# EasyEDA Pro project ProPrj_默语小智管家（ESP32版）_2025-03-15.epro, schematic 默语小智管家ESP32扩展板
Board Name: ESP32版小智扩展板; Create Date: 2025-03-10; Page Name: P1; Project Name: 默语小智管家（ESP32版）; Schematic Name: ESP32版小智扩展板; Update Date: 2025-03-10; Company: MolunSmartHome; Drawed: molun; Page Size: A3; Part Number: JLCPCB-001; Reviewed: molun; Version: V0.1
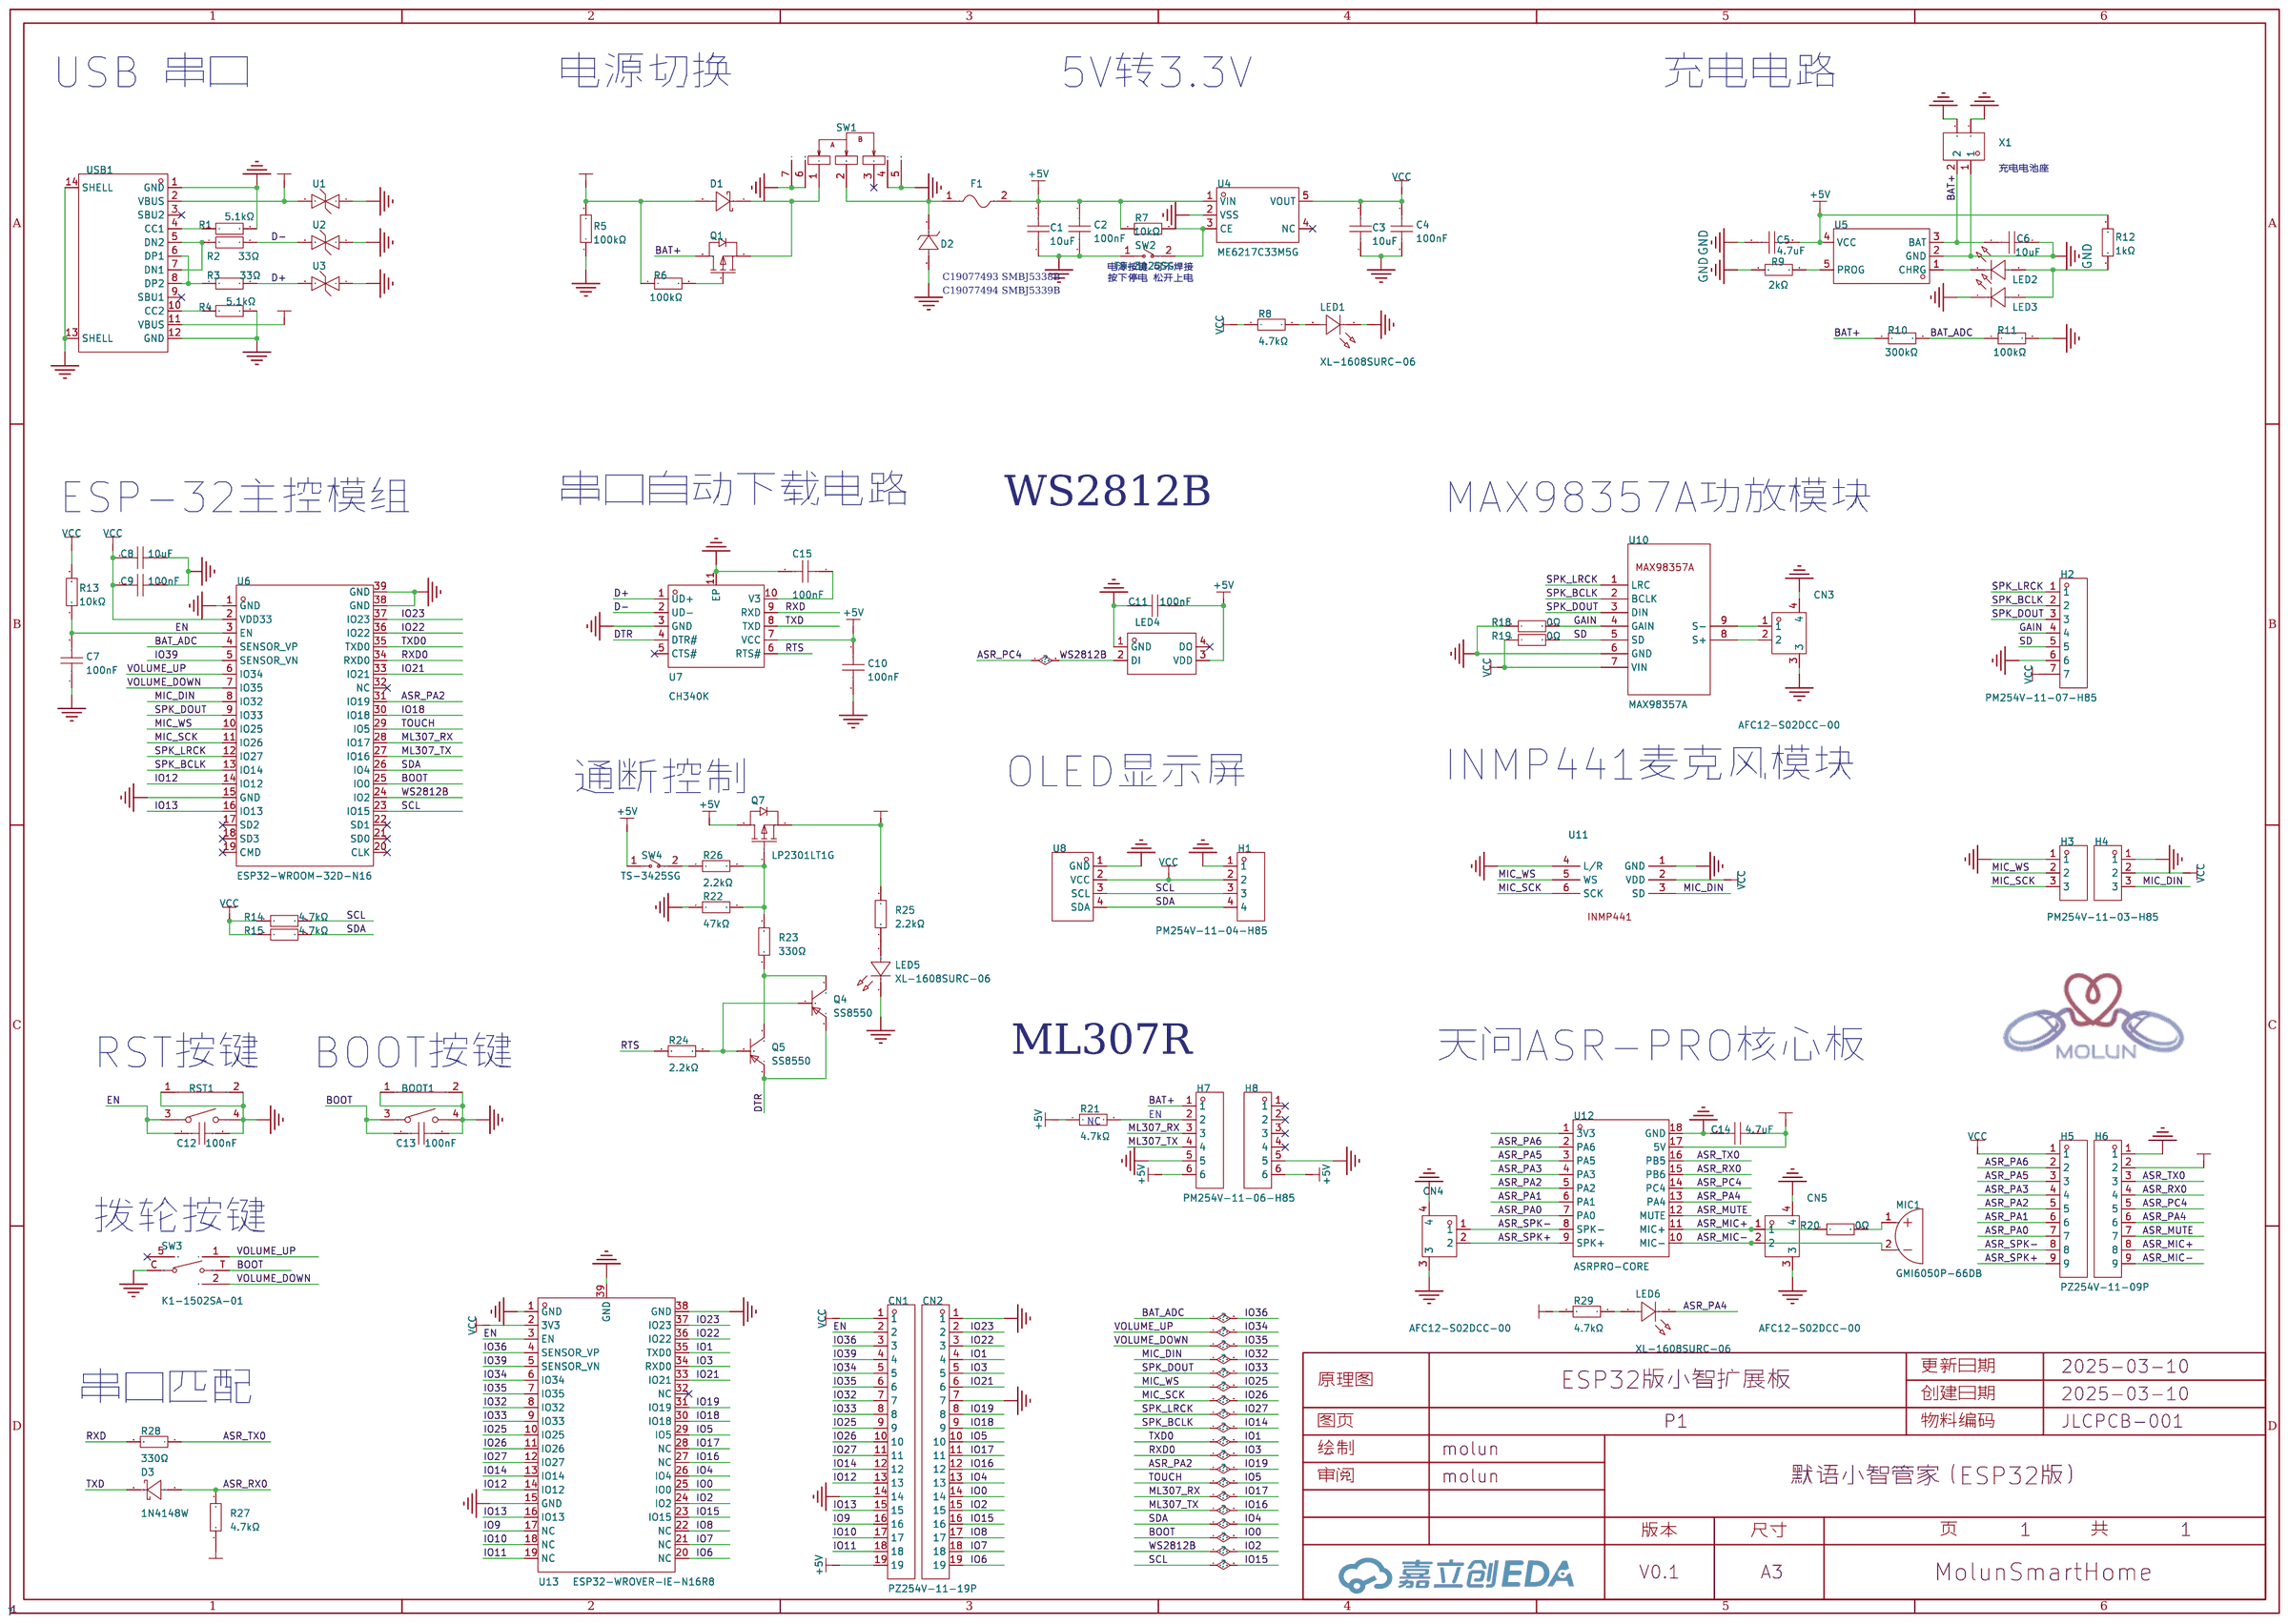
[diagram p1: schematic sheet]

## Parts
BOOT1  TS24CA  [SW-SMD_TS24CA]
C1  10uF  [C0603]
C2  100nF  [C0603]
C3  10uF  [C0603]
C4  100nF  [C0603]
C5  4.7uF  [C0603]
C6  10uF  [C0603]
C7  100nF  [C0603]
C8  10uF  [C0603]
C9  100nF  [C0603]
C10  100nF  [C0603]
C11  100nF  [C0603]
C12  100nF  [C0603]
C13  100nF  [C0603]
C14  4.7uF  [C0603]
C15  100nF  [C0603]
CN1  PZ254V-11-19P  [HDR-TH_19P-P2.54-V-M]
CN2  PZ254V-11-19P  [HDR-TH_19P-P2.54-V-M]
CN3  AFC12-S02DCC-00  [CONN-SMD_AFC12-S02DCC-00]
CN4  AFC12-S02DCC-00  [CONN-SMD_AFC12-S02DCC-00]
CN5  AFC12-S02DCC-00  [CONN-SMD_AFC12-S02DCC-00]
D1  1N5819WS S4  [SOD-323_L1.6-W1.3-LS2.7-RD]
D2  SMBJ5339B  [SMB_L4.6-W3.6-LS5.4-RD]
D3  1N4148W  [SOD-123_L2.7-W1.6-LS3.7-FD]
F1  BSMD0805-050-6V  [F0805]
H1  PM254V-11-04-H85  [HDR-TH_4P-P2.54-V-F]
H2  PM254V-11-07-H85  [HDR-TH_7P-P2.54-V-F]
H3  PM254V-11-03-H85  [HDR-TH_3P-P2.54-V-F]
H4  PM254V-11-03-H85  [HDR-TH_3P-P2.54-V-F]
H5  PZ254V-11-09P  [HDR-TH_9P-P2.54-V-M]
H6  PZ254V-11-09P  [HDR-TH_9P-P2.54-V-M]
H7  PM254V-11-06-H85  [HDR-TH_6P-P2.54-V-F]
H8  PM254V-11-06-H85  [HDR-TH_6P-P2.54-V-F]
LED1  XL-1608SURC-06  [LED0603-RD_RED]
LED2  XL-1608SURC-06  [LED0603-RD_RED]
LED3  XL-1608PGC-06  [LED0603-RD_GREEN]
LED4  XL-3528RGBW-WS2812B  [LED-SMD_4P-L3.5-W2.8-BR-1]
LED5  XL-1608SURC-06  [LED0603-RD_RED]
LED6  XL-1608SURC-06  [LED0603-RD_RED]
MIC1  GMI6050P-66DB  [MIC-TH_BD6.0-P1.90-D0.4-L-RD]
Q1  AO3401A  [SOT-23_L2.9-W1.3-P1.90-LS2.4-BR]
Q4  SS8550  [SOT-23-3_L2.9-W1.3-P1.90-LS2.4-BR]
Q5  SS8550  [SOT-23-3_L2.9-W1.3-P1.90-LS2.4-BR]
Q7  LP2301LT1G  [SOT-23-3_L2.9-W1.3-P1.90-LS2.4-BR]
R1  5.1kΩ  [R0603]
R2  33Ω  [R0603]
R3  33Ω  [R0603]
R4  5.1kΩ  [R0603]
R5  100kΩ  [R0603]
R6  100kΩ  [R0603]
R7  10kΩ  [R0603]
R8  4.7kΩ  [R0603]
R9  2kΩ  [R0603]
R10  300kΩ  [R0603]
R11  100kΩ  [R0603]
R12  1kΩ  [R0603]
R13  10kΩ  [R0603]
R14  4.7kΩ  [R0603]
R15  4.7kΩ  [R0603]
R18  0Ω  [R0603]
R19  0Ω  [R0603]
R20  0Ω  [R0603]
R21  4.7kΩ  [R0603]
R22  47kΩ  [R0603]
R23  330Ω  [R0603]
R24  2.2kΩ  [R0603]
R25  2.2kΩ  [R0603]
R26  2.2kΩ  [R0603]
R27  4.7kΩ  [R0603]
R28  330Ω  [R0603]
R29  4.7kΩ  [R0603]
RST1  TS24CA  [SW-SMD_TS24CA]
SW1  MK-12C02-G020  [SW-SMD_MK-12C02-G020]
SW2  TS-3425SG  [KEY-SMD_L3.9-W3.0-LS5.0_1]
SW3  K1-1502SA-01  [KEY-SMD_K1-1502SA-01]
SW4  TS-3425SG  [KEY-SMD_L3.9-W3.0-LS5.0_1]
U1  RCLAMP0521T-ES  [DFN1006-2L-BI]
U2  RCLAMP0521T-ES  [DFN1006-2L-BI]
U3  RCLAMP0521T-ES  [DFN1006-2L-BI]
U4  ME6217C33M5G  [SOT-23-5_L3.0-W1.7-P0.95-LS2.8-BR]
U5  TP4054  [TSOT-23-5_L2.9-W1.6-P0.95-LS2.8-BR]
U6  ESP32-WROOM-32D-N16  [WIFIM-SMD_39P-L25.5-W18.0-P1.27-BL]
U7  CH340K  [ESOP-10_L4.9-W3.9-P1.00-LS6.2-BL-EP]
U8  HS96L03W2C03  [OLED-TH_L27.8-W27.2-P2.54_C9900033791]
U10  MAX98357A  [max98357 i2s amp module]
U11  INMP441  [INMP441]
U12  ASRPRO-CORE  [COMM-SMD_ASRPRO-CORE-V1.1]
U13  ESP32-WROVER-IE-N16R8  [WIFI-SMD_ESP32-WROVER-E]
USB1  TYPE-C 16PIN 2MD(073)  [USB-C-SMD_TYPE-C-6PIN-2MD-073]
X1  AFC12-S02DCA-00  [SMD_2P-P1.25]

## Library data of the parts
BOOT1 RST1 = TS24CA: 电路结构:单刀单掷;按钮形状:矩形按钮;安装方式:卧贴;开关长度:4.55mm;开关宽度:1.8mm;开关高度:3.5mm;触点电流:50mA;额定电压(DC):12V;带灯:-;机械寿命:-;; LCSC Part Name: 4.55*1.8*3.5mm 卧贴 轻触开关; Supplier Part: C393942; Manufacturer: SHOU HAN(首韩); Supplier Footprint: SMD; JLCPCB Part Class: 扩展库; Datasheet: https://atta.szlcsc.com/upload/public/pdf/source/20190521/C393942_591A9E318887EFA4274D34029981AD99.pdf; Supplier: LCSC; Circuit: 单刀单掷; Actuator Style: 矩形按钮; Mounting Style: 卧贴; Switch Length: 4.55mm; Switch Width: 1.8mm; Switch Height: 3.5mm; Contact Current: 50mA; Voltage Rating (DC): 12V
C1 C3 C6 C8 = CL10A106MA8NRNC: 容值:10uF;精度:±20%;额定电压:25V;材质(温度系数):X5R;; LCSC Part Name: 10uF ±20% 25V; Supplier Part: C96446; Manufacturer: SAMSUNG(三星); Supplier Footprint: 0603; JLCPCB Part Class: 基础库; Datasheet: https://atta.szlcsc.com/upload/public/pdf/source/20160218/1457707763339.pdf; Supplier: LCSC; Tolerance: ±20%; Voltage Rated: 25V; Temperature Coefficient: X5R
C2 C4 C7 C9-C13 C15 = CC0603KRX7R9BB104: 容值:100nF;精度:±10%;额定电压:50V;材质(温度系数):X7R;; LCSC Part Name: 100nF ±10% 50V; Supplier Part: C14663; Manufacturer: YAGEO(国巨); Supplier Footprint: 0603; JLCPCB Part Class: 基础库; Datasheet: https://atta.szlcsc.com/upload/public/pdf/source/20180910/C282072_33301C7F631E79921B82A8DAC6BCC5B3.pdf; Supplier: LCSC; Tolerance: ±10%; Voltage Rated: 50V; Temperature Coefficient: X7R
C5 C14 = CL10A475KO8NNNC: 容值:4.7uF;精度:±10%;额定电压:16V;材质(温度系数):X5R;; LCSC Part Name: 4.7uF ±10% 16V; Supplier Part: C19666; Manufacturer: SAMSUNG(三星); Supplier Footprint: 0603; JLCPCB Part Class: 基础库; Datasheet: https://atta.szlcsc.com/upload/public/pdf/source/20160218/1457707763339.pdf; Supplier: LCSC; Tolerance: ±10%; Voltage Rated: 16V; Temperature Coefficient: X5R
CN1 CN2 = PZ254V-11-19P: 排针2.54mm间距 单排 1x19P 直插 方针; LCSC Part Name: 排针2.54mm间距 单排 1x19P 直插 方针; Supplier Part: C22465879; Manufacturer: XFCN(兴飞); Supplier Footprint: 插件,P=2.54mm; JLCPCB Part Class: 扩展库; Datasheet: https://atta.szlcsc.com/upload/public/pdf/source/20240617/C325FF89D0FCE13B2A10BE2D3D7E6B84.pdf; Supplier: LCSC
CN3-CN5 = AFC12-S02DCC-00: 插针结构:1x2P;间距:1.25mm;安装方式:-;参考系列:-;总PIN数:2P;排数:1;每排PIN数:2;行距:-;触头材质:-;; LCSC Part Name: 1x2P 间距:1.25mm; Supplier Part: C395328; Manufacturer: JS(钜硕电子); Supplier Footprint: SMD,P=1.25mm; JLCPCB Part Class: 扩展库; Datasheet: https://atta.szlcsc.com/upload/public/pdf/source/20190603/C395342_3FDF98F73696725599F7ECEA3EEEB98C.pdf; Supplier: LCSC; Pins Structure: 1x2P; Pitch: 1.25mm; Number of Pins: 2P; Number of Rows: 1; Number of PINs Per Row: 2
D1 = 1N5819WS S4_C2927280: 二极管配置:独立式;正向压降(Vf):600mV@200mA;直流反向耐压(Vr):40V;整流电流:350mA;; LCSC Part Name: 电压:40V 电流:350mA; Supplier Part: C2927280; Manufacturer: JSMSEMI(杰盛微); Supplier Footprint: SOD-323; JLCPCB Part Class: 扩展库; Datasheet: https://atta.szlcsc.com/upload/public/pdf/source/20240105/574E572B69D2DF1CD36E5C05FAB269C4.pdf; Supplier: LCSC; Diode Configuration: 独立式; Forward Voltage (Vf@If): 600mV@200mA; Reverse Voltage (Vr): 40V; Rectified Current: 350mA; Reverse Leakage Current (Ir): 5uA@30V
D2 = SMBJ5339B: 二极管配置:独立式;稳压值(标称值):5.6V;稳压值(范围):5.32V~5.88V;功率(Pd):5W;; Supplier Part: C19077494; Manufacturer: 宏迦橙; Supplier Footprint: SMB; JLCPCB Part Class: 扩展库; Datasheet: https://atta.szlcsc.com/upload/public/pdf/source/20231024/356C06B1F951B7783177D5E20F04BB62.pdf; Supplier: LCSC; Diode Configuration: 独立式; Zener Voltage (Nom): 5.6V; Reverse Leakage Current (Ir): 1uA@2V; Zener Voltage (Range): 5.32V~5.88V; Power Dissipation: 5W; Zener Impedance (Zzt): 1Ω
D3 = 1N4148W_C7420318: 二极管配置:独立式;正向压降(Vf):1.25V@150mA;直流反向耐压(Vr):100V;整流电流:150mA;反向恢复时间(trr):4ns;; Supplier Part: C7420318; Manufacturer: 宏迦橙; Supplier Footprint: SOD-123; JLCPCB Part Class: 扩展库; Datasheet: https://atta.szlcsc.com/upload/public/pdf/source/20230828/E5C3F7A4272052930A7E03B75759BF50.pdf; Supplier: LCSC; Diode Configuration: 独立式; Forward Voltage (Vf@If): 1.25V@150mA; Reverse Voltage (Vr): 100V; Rectified Current: 150mA; Reverse Leakage Current (Ir): 1uA@75V; Reverse Recovery Time (trr): 4ns; Operating Temperature: -55℃~+150℃
F1 = BSMD0805-050-6V: 最大电压:6V;最大电流:40A;保持电流:500mA;跳闸电流:1A;; LCSC Part Name: 6V 500mA 0805自恢复; Supplier Part: C883108; Manufacturer: BHFUSE(佰宏); Supplier Footprint: 0805; JLCPCB Part Class: 扩展库; Datasheet: https://atta.szlcsc.com/upload/public/pdf/source/20230512/7A46D6CD923C15CBB98FD769C08EDD80.pdf; Supplier: LCSC; Operating Voltage (Max): 6V; Current Rating (Max): 40A; Hold Current: 500mA; Trip Current: 1A; Power Dissipation: 500mW; Resistance - Initial (Ri) (Min): 100mΩ; Resistance - Post Trip (R1) (Max): 850mΩ; Maximum Time to Trip: 100ms; Operating Temperature: -40℃~+85℃
H1 = PM254V-11-04-H85: 插孔结构:1x4P;间距:2.54mm;行距:-;安装类型:直插;排数:单排;总孔位数:4P;塑高:-;触头材质:黄铜;触头镀层:-;; LCSC Part Name: 间距:2.54mm 1x4P 直插; Supplier Part: C541851; Manufacturer: XFCN(兴飞); Supplier Footprint: 插件,P=2.54mm; JLCPCB Part Class: 扩展库; Datasheet: https://atta.szlcsc.com/upload/public/pdf/source/20200518/C541849_85853D71FC67C51915A806977A588FDA.pdf; Supplier: LCSC; Holes Structure: 1x4P; Pitch: 2.54mm; Mounting Type: 直插; Number of Rows: 单排; Number of Holes: 4P; Contact Material: 黄铜
H2 = PM254V-11-07-H85: 插孔结构:1x7P;间距:2.54mm;行距:-;圆孔/方孔:方孔;安装类型:直插;排数:单排;总孔位数:7P;额定电流:3A;额定电压:250V;插孔方向:顶部;塑高:-;工作温度范围:-40℃~+105℃;; LCSC Part Name: 间距:2.54mm 1x7P 直插; Supplier Part: C2832270; Manufacturer: XFCN(兴飞); Supplier Footprint: 插件,P=2.54mm; JLCPCB Part Class: 扩展库; Datasheet: https://atta.szlcsc.com/upload/public/pdf/source/20210514/C2832270_F424CC0071A81298BFB56B53406F9842.pdf; Supplier: LCSC; Holes Structure: 1x7P; Pitch: 2.54mm; Circular Hole / Square Hole: 方孔; Mounting Type: 直插; Number of Rows: 单排; Number of Holes: 7P; Current Rating (Max): 3A; Voltage Rating (Max): 250V; Holes Direction: 顶部; Operating Temperature Range: -40℃~+105℃
H3 H4 = PM254V-11-03-H85: 插孔结构:1x3P;间距:2.54mm;行距:-;安装类型:直插;排数:单排;总孔位数:3P;塑高:-;触头材质:黄铜;触头镀层:-;; LCSC Part Name: 间距:2.54mm 1x3P 直插; Supplier Part: C541850; Manufacturer: XFCN(兴飞); Supplier Footprint: 插件,P=2.54mm; JLCPCB Part Class: 扩展库; Datasheet: https://atta.szlcsc.com/upload/public/pdf/source/20200518/C541849_85853D71FC67C51915A806977A588FDA.pdf; Supplier: LCSC; Holes Structure: 1x3P; Pitch: 2.54mm; Mounting Type: 直插; Number of Rows: 单排; Number of Holes: 3P; Contact Material: 黄铜
H5 H6 = PZ254V-11-09P: 插针结构:1x9P;间距:2.54mm;行距:-;圆针/方针:方针;安装类型:直插;排数:单排;总PIN位数:9P;额定电流:-;额定电压:-;配合针长度:6mm;塑高:2.5mm;端接针长度:3mm;触头材质:黄铜;触头镀层:-;工作温度范围:-40℃~+105℃;颜色:黑色;; LCSC Part Name: 间距:2.54mm 1x9P 直插 方针; Supplier Part: C492408; Manufacturer: XFCN(兴飞); Supplier Footprint: 插件,P=2.54mm; JLCPCB Part Class: 扩展库; Datasheet: https://atta.szlcsc.com/upload/public/pdf/source/20200309/C492408_0CE6AEE885DD471CEFA4BE32B6482CF7.pdf; Supplier: LCSC; Pin Structure: 1x9P; Pitch: 2.54mm; Circluar Pins/Square Pins: 方针; Mounting Type: 直插; Number of Rows: 单排; Number of Pins: 9P; Length of Mating Pin: 6mm; Insulation Height: 2.5mm; Length of End Connection Pin: 3mm; Contact Material: 黄铜; Operating Temperature Range: -40℃~+105℃; Color: 黑色
H7 H8 = PM254V-11-06-H85: 插孔结构:1x6P;间距:2.54mm;行距:-;圆孔/方孔:方孔;安装类型:直插;排数:单排;总孔位数:6P;额定电流:3A;额定电压:250V;插孔方向:顶部;塑高:-;工作温度范围:-40℃~+105℃;; LCSC Part Name: 间距:2.54mm 1x6P 直插; Supplier Part: C2832269; Manufacturer: XFCN(兴飞); Supplier Footprint: 插件,P=2.54mm; JLCPCB Part Class: 扩展库; Datasheet: https://atta.szlcsc.com/upload/public/pdf/source/20210514/C2832269_B3EC97736B37C2783BDCE3050AA57447.pdf; Supplier: LCSC; Holes Structure: 1x6P; Pitch: 2.54mm; Circular Hole / Square Hole: 方孔; Mounting Type: 直插; Number of Rows: 单排; Number of Holes: 6P; Current Rating (Max): 3A; Voltage Rating (Max): 250V; Holes Direction: 顶部; Operating Temperature Range: -40℃~+105℃
LED1 LED2 LED5 LED6 = XL-1608SURC-06: 发光颜色:红色;功率:55mW;正向电流:25mA;主波长:617nm~621nm;透镜颜色:无色透明透镜;色温:-;发光角度:120°;载带方式:正贴;工作温度:-30℃~+85℃;; Supplier Part: C965799; Manufacturer: XINGLIGHT(成兴光); Supplier Footprint: 0603; JLCPCB Part Class: 扩展库; Datasheet: https://atta.szlcsc.com/upload/public/pdf/source/20221102/D860AFDD1CDB02C5A8064103A32707E2.pdf; Supplier: LCSC; Emitted Color: 红色; Power Dissipation: 55mW; Forward Current: 25mA; Dominant Wavelength: 617nm~621nm; Peak Wavelength: 623nm; Lens Color: 无色透明透镜; Viewing Angle: 120°; Mounting Sytle: 正贴; Operating Temperature: -30℃~+85℃
LED3 = XL-1608PGC-06: 灯头类型:-;发光颜色:翠绿色;正向电压(VF):2.6V~3V;功率:75mW;正向电流:5mA;主波长:505nm~540nm;二极管配置:-;透镜颜色:绿色透镜;色温:-;发光强度:299mcd;发光角度:130°;载带方式:正贴;工作温度:-;; Supplier Part: C7371905; Manufacturer: XINGLIGHT(成兴光); Supplier Footprint: 0603; JLCPCB Part Class: 扩展库; Datasheet: https://atta.szlcsc.com/upload/public/pdf/source/20240218/2F8A7AF596DEEB38157DAB7856E382C0.pdf; Supplier: LCSC; Emitted Color: 翠绿色; Forward Voltage (VF): 2.6V~3V; Power Dissipation: 75mW; Forward Current: 5mA; Dominant Wavelength: 505nm~540nm; Peak Wavelength: 530nm; Lens Color: 绿色透镜; Luminous Intensity: 299mcd; Viewing Angle: 130°; Mounting Sytle: 正贴
LED4 = XL-3528RGBW-WS2812B: 3528 七彩幻彩雾状 ws2812B 内置驱动IC; Supplier Part: C2890364; Manufacturer: XINGLIGHT(成兴光); Supplier Footprint: SMD3528-4P; JLCPCB Part Class: 扩展库; Datasheet: https://atta.szlcsc.com/upload/public/pdf/source/20240218/041E1E0D0024617DFFF124D9C311BB4D.pdf; Supplier: LCSC
MIC1 = GMI6050P-66DB: LCSC Part Name: 全指向φ6.0*5.0mm 1.5V-10V 灵敏度-66db 低阻抗 针脚; Supplier Part: C233954; Manufacturer: INGHAi(赢海); Supplier Footprint: 插件,D=6mm; JLCPCB Part Class: 扩展库; Datasheet: https://atta.szlcsc.com/upload/public/pdf/source/20200109/C233954_0ED01E8B209C3B49E54D20B14373208C.pdf; Supplier: LCSC
Q1 = AO3401A_C347476: 类型:1个P沟道;漏源电压(Vdss):30V;连续漏极电流(Id):4.2A;功率(Pd):1.4W;导通电阻(RDS(on)@Vgs,Id):50mΩ@4.2A,10V;阈值电压(Vgs(th)@Id):1.3V@250uA;; LCSC Part Name: 1个P沟道 耐压:30V 电流:4.2A; Supplier Part: C347476; Manufacturer: UMW(友台半导体); Supplier Footprint: SOT-23; JLCPCB Part Class: 扩展库; Datasheet: https://atta.szlcsc.com/upload/public/pdf/source/20231109/42F312EBB081D72F04A7E8221BFFAF9D.pdf; Supplier: LCSC; Type: 1个P沟道; Drain Source Voltage (Vdss): 30V; Continuous Drain Current (Id): 4.2A; Power Dissipation (Pd): 1.4W; Drain Source On Resistance (RDS(on)@Vgs,Id): 50mΩ@4.2A,10V; Gate Threshold Voltage (Vgs(th)@Id): 1.3V@250uA; Total Gate Charge (Qg@Vgs): 9.4nC@4.5V; Input Capacitance (Ciss@Vds): 954pF@15V
Q4 Q5 = SS8550_C916393: 晶体管类型:PNP;集电极电流(Ic):1.5A;集射极击穿电压(Vceo):25V;耗散功率(Pd):300mW;直流电流增益(hFE):400@100mA,1V;; Supplier Part: C916393; Manufacturer: JSMSEMI(杰盛微); Supplier Footprint: SOT-23; JLCPCB Part Class: 扩展库; Datasheet: https://atta.szlcsc.com/upload/public/pdf/source/20230807/3604410A438CB5F781EA32A01753567F.pdf; Supplier: LCSC; type: PNP; Current - Collector(Ic): 1.5A; Collector - Emitter Voltage VCEO: 25V; Pd - Power Dissipation: 300mW; DC Current Gain: 400@100mA,1V; Transition frequency(fT): 100MHz; Current - Collector Cutoff: 100nA; Vce Saturation(VCE(sat)): 500mV
Q7 = LP2301LT1G: 类型:1个P沟道;漏源电压(Vdss):20V;连续漏极电流(Id):2.3A;导通电阻(RDS(on)@Vgs,Id):100mΩ@4.5V,2.8A;功率(Pd):570mW;阈值电压(Vgs(th)@Id):400mV@250uA;; LCSC Part Name: 1个P沟道 耐压:20V 电流:2.3A; Supplier Part: C77937; Manufacturer: LRC(乐山无线电); Supplier Footprint: SOT-23; JLCPCB Part Class: 扩展库; Datasheet: https://atta.szlcsc.com/upload/public/pdf/source/20160706/1467801115774.pdf; Supplier: LCSC; Type: 1个P沟道; Drain Source Voltage (Vdss): 20V; Continuous Drain Current (Id): 2.3A; Drain Source On Resistance (RDS(on)@Vgs,Id): 100mΩ@4.5V,2.8A; Power Dissipation (Pd): 570mW; Gate Threshold Voltage (Vgs(th)@Id): 400mV@250uA; Total Gate Charge (Qg@Vgs): 15.23nC@4.5V; Input Capacitance (Ciss@Vds): 882.5pF; Reverse Transfer Capacitance (Crss@Vds): 97.26pF@6V; Operating Temperature: -55℃~+150℃
R1 R4 = 0603WAF5101T5E: 电阻类型:厚膜电阻;阻值:5.1kΩ;精度:±1%;功率:100mW;最大工作电压:75V;温度系数:±100ppm/℃;; LCSC Part Name: 5.1kΩ ±1% 100mW 厚膜电阻; Supplier Part: C23186; Manufacturer: UNI-ROYAL(厚声); Supplier Footprint: 0603; JLCPCB Part Class: 基础库; Datasheet: https://atta.szlcsc.com/upload/public/pdf/source/20200306/C422600_1E6D84923E4A46A82E41ADD87F860B5C.pdf; Supplier: LCSC; Type: 厚膜电阻; Tolerance: ±1%; Power(Watts): 100mW; Overload Voltage (Max): 75V; Temperature Coefficient: ±100ppm/℃; Operating Temperature Range: -55℃~+155℃
R2 R3 = RC0603JR-0733RL: 电阻类型:厚膜电阻;阻值:33Ω;精度:±5%;功率:100mW;最大工作电压:75V;温度系数:±100ppm/℃;; LCSC Part Name: 厚膜电阻 33Ω ±5% 100mW; Supplier Part: C108407; Manufacturer: YAGEO(国巨); Supplier Footprint: 0603; Datasheet: https://atta.szlcsc.com/upload/public/pdf/source/20170704/1499151277197.pdf; Supplier: LCSC; Type: 厚膜电阻; Tolerance: ±5%; Power(Watts): 100mW; Overload Voltage (Max): 75V; Temperature Coefficient: ±100ppm/℃; Operating Temperature Range: -55℃~+155℃
R5 R6 R11 = RC0603FR-07100KL: 电阻类型:厚膜电阻;阻值:100kΩ;精度:±1%;功率:100mW;最大工作电压:75V;温度系数:±100ppm/℃;; LCSC Part Name: 厚膜电阻 100kΩ ±1% 100mW; Supplier Part: C14675; Manufacturer: YAGEO(国巨); Supplier Footprint: 0603; JLCPCB Part Class: 扩展库; Datasheet: https://atta.szlcsc.com/upload/public/pdf/source/20140324/1457707028752.pdf; Supplier: LCSC; Type: 厚膜电阻; Tolerance: ±1%; Power(Watts): 100mW; Overload Voltage (Max): 75V; Temperature Coefficient: ±100ppm/℃; Operating Temperature Range: -55℃~+155℃
R7 R13 = 0603WAF1002T5E: 电阻类型:厚膜电阻;阻值:10kΩ;精度:±1%;功率:100mW;最大工作电压:75V;温度系数:±100ppm/℃;; LCSC Part Name: 厚膜电阻 10kΩ ±1% 100mW; Supplier Part: C25804; Manufacturer: UNI-ROYAL(厚声); Supplier Footprint: 0603; JLCPCB Part Class: 基础库; Datasheet: https://atta.szlcsc.com/upload/public/pdf/source/20200306/C422600_1E6D84923E4A46A82E41ADD87F860B5C.pdf; Supplier: LCSC; Type: 厚膜电阻; Tolerance: ±1%; Power(Watts): 100mW; Overload Voltage (Max): 75V; Temperature Coefficient: ±100ppm/℃; Operating Temperature Range: -55℃~+155℃
R8 R14 R15 R21 R27 R29 = RC0603JR-074K7L: 电阻类型:厚膜电阻;阻值:4.7kΩ;精度:±5%;功率:100mW;最大工作电压:75V;温度系数:±100ppm/℃;; LCSC Part Name: 厚膜电阻 4.7kΩ ±5% 100mW; Supplier Part: C105428; Manufacturer: YAGEO(国巨); Supplier Footprint: 0603; JLCPCB Part Class: 扩展库; Datasheet: https://atta.szlcsc.com/upload/public/pdf/source/20180316/70C0E2BDAE7FCC62C531A5A58D202EE1.pdf; Supplier: LCSC; Type: 厚膜电阻; Tolerance: ±5%; Power(Watts): 100mW; Overload Voltage (Max): 75V; Temperature Coefficient: ±100ppm/℃; Operating Temperature Range: -55℃~+155℃
R9 = RC0603FR-072KL: 电阻类型:厚膜电阻;阻值:2kΩ;精度:±1%;功率:100mW;最大工作电压:75V;温度系数:±100ppm/℃;; LCSC Part Name: 厚膜电阻 2kΩ ±1% 100mW; Supplier Part: C105576; Manufacturer: YAGEO(国巨); Supplier Footprint: 0603; JLCPCB Part Class: 扩展库; Datasheet: https://atta.szlcsc.com/upload/public/pdf/source/20180316/70C0E2BDAE7FCC62C531A5A58D202EE1.pdf; Supplier: LCSC; Type: 厚膜电阻; Tolerance: ±1%; Power(Watts): 100mW; Overload Voltage (Max): 75V; Temperature Coefficient: ±100ppm/℃; Operating Temperature Range: -55℃~+155℃
R10 = 0603WAF3003T5E: 电阻类型:厚膜电阻;阻值:300kΩ;精度:±1%;功率:100mW;最大工作电压:75V;温度系数:±100ppm/℃;; LCSC Part Name: 300kΩ ±1% 100mW 厚膜电阻; Supplier Part: C23024; Manufacturer: UNI-ROYAL(厚声); Supplier Footprint: 0603; JLCPCB Part Class: 基础库; Datasheet: https://atta.szlcsc.com/upload/public/pdf/source/20200306/C422600_1E6D84923E4A46A82E41ADD87F860B5C.pdf; Supplier: LCSC; Type: 厚膜电阻; Tolerance: ±1%; Power(Watts): 100mW; Overload Voltage (Max): 75V; Temperature Coefficient: ±100ppm/℃; Operating Temperature Range: -55℃~+155℃
R12 = 0603WAF1001T5E: 电阻类型:厚膜电阻;阻值:1kΩ;精度:±1%;功率:100mW;最大工作电压:75V;温度系数:±100ppm/℃;; LCSC Part Name: 1kΩ ±1% 100mW 厚膜电阻; Supplier Part: C21190; Manufacturer: UNI-ROYAL(厚声); Supplier Footprint: 0603; JLCPCB Part Class: 基础库; Datasheet: https://atta.szlcsc.com/upload/public/pdf/source/20200306/C422600_1E6D84923E4A46A82E41ADD87F860B5C.pdf; Supplier: LCSC; Type: 厚膜电阻; Tolerance: ±1%; Power(Watts): 100mW; Overload Voltage (Max): 75V; Temperature Coefficient: ±100ppm/℃; Operating Temperature Range: -55℃~+155℃
R18-R20 = 0603WAF0000T5E: 电阻类型:厚膜电阻;阻值:0Ω;精度:±1%;功率:100mW;最大工作电压:75V;; LCSC Part Name: 0Ω ±1% 100mW 厚膜电阻; Supplier Part: C21189; Manufacturer: UNI-ROYAL(厚声); Supplier Footprint: 0603; JLCPCB Part Class: 基础库; Datasheet: https://atta.szlcsc.com/upload/public/pdf/source/20200306/C422600_1E6D84923E4A46A82E41ADD87F860B5C.pdf; Supplier: LCSC; Type: 厚膜电阻; Tolerance: ±1%; Power(Watts): 100mW; Overload Voltage (Max): 75V; Operating Temperature Range: -55℃~+155℃
R22 = 0603WAF4702T5E: 电阻类型:厚膜电阻;阻值:47kΩ;精度:±1%;功率:100mW;最大工作电压:75V;温度系数:±100ppm/℃;; LCSC Part Name: 47kΩ ±1% 100mW 厚膜电阻; Supplier Part: C25819; Manufacturer: UNI-ROYAL(厚声); Supplier Footprint: 0603; JLCPCB Part Class: 基础库; Datasheet: https://atta.szlcsc.com/upload/public/pdf/source/20200306/C422600_1E6D84923E4A46A82E41ADD87F860B5C.pdf; Supplier: LCSC; Type: 厚膜电阻; Tolerance: ±1%; Power(Watts): 100mW; Overload Voltage (Max): 75V; Temperature Coefficient: ±100ppm/℃; Operating Temperature Range: -55℃~+155℃
R23 R28 = 0603WAF3300T5E: 电阻类型:厚膜电阻;阻值:330Ω;精度:±1%;功率:100mW;最大工作电压:75V;温度系数:±100ppm/℃;; LCSC Part Name: 330Ω ±1% 100mW 厚膜电阻; Supplier Part: C23138; Manufacturer: UNI-ROYAL(厚声); Supplier Footprint: 0603; JLCPCB Part Class: 基础库; Datasheet: https://atta.szlcsc.com/upload/public/pdf/source/20200306/C422600_1E6D84923E4A46A82E41ADD87F860B5C.pdf; Supplier: LCSC; Type: 厚膜电阻; Tolerance: ±1%; Power(Watts): 100mW; Overload Voltage (Max): 75V; Temperature Coefficient: ±100ppm/℃; Operating Temperature Range: -55℃~+155℃
R24-R26 = 0603WAF2201T5E: 电阻类型:厚膜电阻;阻值:2.2kΩ;精度:±1%;功率:100mW;最大工作电压:75V;温度系数:±100ppm/℃;; LCSC Part Name: 2.2kΩ ±1% 100mW 厚膜电阻; Supplier Part: C4190; Manufacturer: UNI-ROYAL(厚声); Supplier Footprint: 0603; JLCPCB Part Class: 基础库; Datasheet: https://atta.szlcsc.com/upload/public/pdf/source/20200306/C422600_1E6D84923E4A46A82E41ADD87F860B5C.pdf; Supplier: LCSC; Type: 厚膜电阻; Tolerance: ±1%; Power(Watts): 100mW; Overload Voltage (Max): 75V; Temperature Coefficient: ±100ppm/℃; Operating Temperature Range: -55℃~+155℃
SW1 = MK-12C02-G020: 电路结构:单刀双掷;安装方式:卧贴;开关颜色:黑色;额定电流(DC):1A;额定电压(DC):6V;机械寿命:1万次;; LCSC Part Name: 微型拨动开关; Supplier Part: C963206; Manufacturer: G-Switch(品赞); Supplier Footprint: SMD; JLCPCB Part Class: 扩展库; Datasheet: https://atta.szlcsc.com/upload/public/pdf/source/20200902/C778186_2AF08473ED98414D93A175E8814EEFA6.pdf; Supplier: LCSC; Circuit: 单刀双掷; Actuator Style: 矩形柱状; Pin Style: SMD接片; Switch Length: 6.6mm; Switch Width: 2.7mm; Switch Height: 4.7mm; Mounting Style: 卧贴; Actuator Color: 黑色; Current Rating (DC): 1A; Voltage Rating (DC): 6V; Mechanical Life: 1万次; Operating Temperature: -20℃~+70℃
SW2 SW4 = TS-3425SG: 作用力:2.5N;开关长度:4mm;开关宽度:3mm;开关高度:2.5mm;机械寿命:5万次;; LCSC Part Name: 3*4*2.5mm 二脚小龟 轻触开关 黑圆键 弹力250gf 编带; Supplier Part: C19779116; Manufacturer: 康深; Supplier Footprint: SMD,3.9x2.5mm; JLCPCB Part Class: 扩展库; Datasheet: https://atta.szlcsc.com/upload/public/pdf/source/20231226/07E9F2D141EF020E00CF8CEEA9953434.pdf; Supplier: LCSC; Operating Force: 2.5N; Switch Length: 4mm; Switch Width: 3mm; Switch Height: 2.5mm; Actuator/Cap Color: 黑色; Mechanical Life: 5万次
SW3 = K1-1502SA-01: Supplier Part: C145915; Manufacturer: 韩国韩荣; Supplier Footprint: SMD,11.8x12.4mm; JLCPCB Part Class: 扩展库; Datasheet: https://atta.szlcsc.com/upload/public/pdf/source/20210810/68556D289DEA90EEE2C9C67C3CF0D02D.pdf; Supplier: LCSC
U1-U3 = RCLAMP0521T-ES: 极性:双向;反向截止电压(Vrwm):5V;最大钳位电压:18V;峰值脉冲电流(Ipp):4A;峰值脉冲功率(Ppp):80W;击穿电压:6V;; LCSC Part Name: 0521/0531，单路双向ESD静电防护器件，20kV，CJ：0.25pF；HDMI/USB/NFC/RF超高速接口通讯防护; Supplier Part: C5180263; Manufacturer: ElecSuper(静芯微); Supplier Footprint: DFN1006-2L; JLCPCB Part Class: 扩展库; Datasheet: https://atta.szlcsc.com/upload/public/pdf/source/20240905/E90AFA5EC59D44930BEC0D45A1143918.pdf; Supplier: LCSC; polarity: 双向; Reverse Stand-Off Voltage (Vrwm): 5V; Maximum Clamping Voltage: 18V; Peak Pulse Current (Ipp): 4A; Peak Pulse Power Dissipation (Ppp): 80W; Breakdown Voltage: 6V; Reverse Leakage Current (Ir): 1uA; Number of Lines: 单路; Type: ESD
U4 = ME6217C33M5G: 输出类型:固定;最大输入电压:7V;输出电压:3.3V;最大输出电流:800mA;电源纹波抑制比(PSRR):65dB@(1kHz);输出极性:正极;; LCSC Part Name: 输入7V 输出3.3V 800mA; Supplier Part: C427602; Manufacturer: MICRONE(南京微盟); Supplier Footprint: SOT-23-5; JLCPCB Part Class: 扩展库; Datasheet: https://atta.szlcsc.com/upload/public/pdf/source/20190910/C427602_D4B9162A2E9D9EF57C60010DFDECEF37.pdf; Supplier: LCSC; Output Type: 固定; Maximum Input Voltage: 7V; Output Voltage: 3.3V; MAX Output Current: 800mA; Power Supply Rejection Ratio (PSRR): 65dB@(1kHz); Dropout Voltage: 180mV@(300mA); Output Polarity: 正极; Number of Outputs: 1
U5 = TP4054_C668215: 电源电压:6.5V;最大充电电流:500mA;电池类型:锂离子/聚合物;电池节数:1;; Supplier Part: C668215; Manufacturer: UMW(友台半导体); Supplier Footprint: SOT-23-5L; Datasheet: https://atta.szlcsc.com/upload/public/pdf/source/20231109/1E60770826C4E1A0E5898BBC08FF3A57.pdf; Supplier: LCSC; Supply Voltage: 6.5V; Maximum Charge Current: 500mA; Type of Battery: 锂离子/聚合物; Number of Cells: 1; Operating Temperature: -40℃~+85℃
U6 = ESP32-WROOM-32D-N16: LCSC Part Name: 通用型Wi-Fi+BT+BLE MCU模组; Supplier Part: C529578; Manufacturer: ESPRESSIF(乐鑫); Supplier Footprint: SMD,18x25.5mm; JLCPCB Part Class: 扩展库; Datasheet: https://atta.szlcsc.com/upload/public/pdf/source/20200521/C529577_90A62DBC94C4A28650A646C18DE51576.pdf; Supplier: LCSC
U7 = CH340K: 应用功能:USB转串口;接口协议:USB 2.0;通道数:-;数据速率:2Mbps;; LCSC Part Name: USB转串口芯片CH340; Supplier Part: C968586; Manufacturer: WCH(南京沁恒); Supplier Footprint: ESSOP-10-150mil-1mm; JLCPCB Part Class: 扩展库; Datasheet: https://atta.szlcsc.com/upload/public/pdf/source/20240313/C21A12AB66F63ABF8F8743FF13A35C95.pdf; Supplier: LCSC; Applications Function: USB转串口; Protocol: USB 2.0; Supply Voltage: 3.3V；5V; Data Rate: 2Mbps; Operating Temperature: -20℃~+70℃
U8 = HS96L03W2C03: 主控芯片:SSD1315;接口类型:I2C;尺寸(inch):0.96;像素分辨率:128x64;; LCSC Part Name: 0.96寸OLED显示屏窄白光IIC; Supplier Part: C5248080; Manufacturer: HS(汉昇); JLCPCB Part Class: 扩展库; Datasheet: https://atta.szlcsc.com/upload/public/pdf/source/20230627/763D01F79A90007632F098068C7C8AD9.pdf; Supplier: LCSC; Main Control Chip: SSD1315; Interface Type: I2C; Size: 0.96; Pixel Resolution: 128x64; Operating Temperature: -40℃~+70℃
U10 = MAX98357A: MAX98357A I2S 功放模块
U11 = INMP441
U12 = ASRPRO-CORE: Supplier Part: C9900058401; Supplier Footprint: SMD-18P; JLCPCB Part Class: 扩展库; Supplier: LCSC
U13 = ESP32-WROVER-IE-N16R8: ESP32-WROVER-IE 集成 ESP32-D0WD-V3 芯片 18x31.4x3.3; LCSC Part Name: 通用型Wi-Fi+BT+BLE MCU模组; Supplier Part: C701352; Manufacturer: ESPRESSIF(乐鑫); Supplier Footprint: SMD,18x31.4mm; JLCPCB Part Class: 扩展库; Datasheet: https://atta.szlcsc.com/upload/public/pdf/source/20200730/C701352_037A60005F1BF393F126A44EB320B018.pdf; Supplier: LCSC
USB1 = TYPE-C 16PIN 2MD(073): 连接器类型:Type-C;标准:USB 3.1;公母:母;安装方式:卧贴;触点数量:16P;端口数量:1;额定电流 - 电源:5A;工作温度范围:-25℃~+85℃;; LCSC Part Name: Type-C 母 卧贴; Supplier Part: C2765186; Manufacturer: SHOU HAN(首韩); Supplier Footprint: SMD; JLCPCB Part Class: 扩展库; Datasheet: https://atta.szlcsc.com/upload/public/pdf/source/20211123/39B17C16241EAC15C5E277BDA434118E.pdf; Supplier: LCSC; Connector Type: Type-C; Standard: USB 3.1; Gender: 母; Mounting Style: 卧贴; Number of Contacts: 16P; Number of Ports: 1; Current Rating - Power (Max): 5A; Operating Temperature Range: -25℃~+85℃; Rated Voltage (Max): 5V; Connect-Disconnect Life: 5千次; Core Colour: 黑色
X1 = AFC12-S02DCA-00: 插针结构:1x2P;间距:1.25mm;安装方式:卧贴;参考系列:-;总PIN数:2P;排数:1;每排PIN数:2;行距:-;额定电流:1A;工作温度范围:-20℃~+85℃;; LCSC Part Name: 1x2P 间距:1.25mm 卧贴; Supplier Part: C466538; Manufacturer: JS(钜硕电子); Supplier Footprint: SMD,P=1.25mm,卧贴; JLCPCB Part Class: 扩展库; Datasheet: https://atta.szlcsc.com/upload/public/pdf/source/20191211/C466543_1944CC24B799268ED4D26E9C7CC66BEC.pdf; Supplier: LCSC; Pins Structure: 1x2P; Pitch: 1.25mm; Mounting Style: 卧贴; Number of Pins: 2P; Number of Rows: 1; Number of PINs Per Row: 2; Current Rating (Max): 1A; Operating Temperature Range: -20℃~+85℃

## Nets
+5V: C1.2 C2.1 C5.2 C10.1 C11.2 CN1.19 F1.2 H7.6 H8.6 LED4.3(VDD) Q7.3(D) R7.1 R12.2 R21.1 SW4.1 U4.1(VIN) U5.4(VCC) U7.7(VCC)
GND: BOOT1.1 BOOT1.2 BOOT1.4 C1.1 C2.2 C3.1 C4.2 C5.1 C6.1 C7.1 C8.1 C9.2 C10.2 C11.1 C12.2 C13.2 C14.2 C15.2 CN1.14 CN2.1 CN2.7 CN3.3 CN3.4 CN4.3 CN4.4 CN5.3 CN5.4 D2.2(A) H1.1 H2.6 H3.1 H4.1 H6.1 H7.5 H8.5 LED1.1(K) LED3.1(K) LED4.1(GND) LED5.1(K) R1.2 R4.2 R5.1 R9.1 R11.2 R18.1 R22.1 RST1.1 RST1.2 RST1.4 SW1.4 SW1.5 SW1.6 SW1.7 SW2.1 SW3.C U1.1 U2.1 U3.1 U4.2(VSS) U5.2(GND) U6.1(GND) U6.15(GND) U6.38(GND) U6.39(GND) U7.3(GND) U7.11(EP) U8.1(GND) U10.6(GND) U11.1(GND) U11.4(L/R) U12.18(GND) U13.1(GND) U13.15(GND) U13.38(GND) U13.39(GND) USB1.1(GND) USB1.12(GND) USB1.13(SHELL) USB1.14(SHELL) X1.1 X1.3 X1.4
VBUS: D1.2(A) R5.2 R6.1 U1.2 USB1.2(VBUS) USB1.11(VBUS)
VCC: C3.2 C4.1 C8.2 C9.1 CN1.1 H1.2 H2.7 H4.2 H5.1 R8.1 R13.2 R14.1 R15.1 R19.1 U4.5(VOUT) U6.2(VDD33) U8.2(VCC) U10.7(VIN) U11.2(VDD) U13.2(3V3)
ASR_MIC+: CN5.1 H6.8 R20.1 U12.11(MIC+)
ASR_MIC-: CN5.2 H6.9 MIC1.2 U12.10(MIC-)
ASR_MUTE: H6.7 U12.12(MUTE)
ASR_PA0: H5.7 U12.7(PA0)
ASR_PA1: H5.6 U12.6(PA1)
ASR_PA2: CN2.8 H5.5 U6.31(IO19) U12.5(PA2) U13.31(IO19)
ASR_PA3: H5.4 U12.4(PA3)
ASR_PA4: H6.6 LED6.1(K) U12.13(PA4)
ASR_PA5: H5.3 U12.3(PA5)
ASR_PA6: H5.2 U12.2(PA6)
ASR_PC4: CN2.15 H6.5 LED4.2(DI) U6.24(IO2) U12.14(PC4) U13.24(IO2)
ASR_RX0: D3.1(A) H6.4 R27.2 U12.15(PB6)
ASR_SPK+: CN4.2 H5.9 U12.9(SPK+)
ASR_SPK-: CN4.1 H5.8 U12.8(SPK-)
ASR_TX0: H6.3 R28.1 U12.16(PB5)
BAT+: C6.2 H7.1 Q1.3(D) R10.1 U5.3(BAT) X1.2
BAT_ADC: CN1.3 R10.2 R11.1 U6.4(SENSOR_VP) U13.4(SENSOR_VP)
BOOT: BOOT1.3 C13.1 CN2.14 SW3.T U6.25(IO0) U13.25(IO0)
D+: R3.2 U3.2 U7.1(UD+)
D-: R2.2 U2.2 U7.2(UD-)
DTR: Q4.2(E) Q5.2(E) U7.4(DTR#)
EN: C7.2 C12.1 CN1.2 R13.1 RST1.3 U6.3(EN) U13.3(EN)
GAIN: H2.4 R18.2 U10.4(GAIN)
IO1: CN2.4 U6.35(TXD0) U13.35(TXD0)
IO3: CN2.5 U6.34(RXD0) U13.34(RXD0)
IO4: CN2.13 H1.4 R15.2 U6.26(IO4) U8.4(SDA) U13.26(IO4)
IO5: CN2.10 U6.29(IO5) U13.29(IO5)
IO6: CN2.19 U13.20(NC)
IO7: CN2.18 U13.21(NC)
IO8: CN2.17 U13.22(NC)
IO9: CN1.16 U13.17(NC)
IO10: CN1.17 U13.18(NC)
IO11: CN1.18 U13.19(NC)
IO12: CN1.13 U6.14(IO12) U13.14(IO12)
IO13: CN1.15 U6.16(IO13) U13.16(IO13)
IO14: CN1.12 H2.2 U6.13(IO14) U10.2(BCLK) U13.13(IO14)
IO15: CN2.16 H1.3 R14.2 U6.23(IO15) U8.3(SCL) U13.23(IO15)
IO16: CN2.12 H7.4 U6.27(IO16) U13.27(NC)
IO17: CN2.11 H7.3 U6.28(IO17) U13.28(NC)
IO18: CN2.9 U6.30(IO18) U13.30(IO18)
IO21: CN2.6 U6.33(IO21) U13.33(IO21)
IO22: CN2.3 U6.36(IO22) U13.36(IO22)
IO23: CN2.2 U6.37(IO23) U13.37(IO23)
IO25: CN1.9 H3.2 U6.10(IO25) U11.5(WS) U13.10(IO25)
IO26: CN1.10 H3.3 U6.11(IO26) U11.6(SCK) U13.11(IO26)
IO27: CN1.11 H2.1 U6.12(IO27) U10.1(LRC) U13.12(IO27)
IO32: CN1.7 H4.3 U6.8(IO32) U11.3(SD) U13.8(IO32)
IO33: CN1.8 H2.3 U6.9(IO33) U10.3(DIN) U13.9(IO33)
IO34: CN1.5 SW3.1 U6.6(IO34) U13.6(IO34)
IO35: CN1.6 SW3.2 U6.7(IO35) U13.7(IO35)
IO39: CN1.4 U6.5(SENSOR_VN) U13.5(SENSOR_VN)
RTS: R24.1 U7.6(RTS#)
RXD: R28.2 U7.9(RXD)
SD: H2.5 R19.2 U10.5(SD)
TXD: D3.2(K) U7.8(TXD)
VOUT: C14.1 H6.2 Q7.2(S) R25.2 R27.1 R29.1 U12.17(5V)
$1N1838: LED1.2(A) R8.2
$1N2780: Q4.1(B) Q5.1(B) R24.2
$1N3301: R2.1 USB1.5(DN2) USB1.7(DN1)
$1N3302: R3.1 USB1.6(DP1) USB1.8(DP2)
$1N3308: R4.1 USB1.10(CC2)
$1N3309: R1.1 USB1.4(CC1)
$1N3816: R9.2 U5.5(PROG)
$1N4189: D2.1(K) F1.1 SW1.2
$1N4190: D1.1(C) Q1.2(S) SW1.1
$1N4194: Q1.1(G) R6.2
$1N20777: CN3.2 U10.8(S+)
$1N20779: CN3.1 U10.9(S-)
$1N33425: H7.2 R21.2
$1N38902: Q4.3(C) Q5.3(C) R23.1
$1N38957: Q7.1(G) R22.2 R23.2 R26.2
$1N39010: C15.1 U7.10(V3)
$1N39448: LED5.2(A) R25.1
$1N39986: LED6.2(A) R29.2
Net-(LED2-1): LED2.1(K) U5.1(CHRG)
Net-(LED2-2): LED2.2(A) LED3.2(A) R12.1
Net-(MIC1-1): MIC1.1 R20.2
Net-(R7-2): R7.2 SW2.2 U4.3(CE)
Net-(R26-1): R26.1 SW4.2

Not connected (* = marked no-connect by the designer): H8 1* 2* 3* 4*; LED4 4(DO)*; SW1 3*; SW3 5*; U4 4(NC)*; U6 17(SD2)* 18(SD3)* 19(CMD)* 20(CLK)* 21(SD0)* 22(SD1)* 32(NC)*; U7 5(CTS#)*; U12 1(3V3); U13 32(NC)*; USB1 3(SBU2)* 9(SBU1)*

## Notes on the sheet
- USB 串口
- 电源切换
- 5V转3.3V
- 充电电路
- 充电电池座
- C19077493 SMBJ5338B
- 电源按键 可不焊接
  按下停电 松开上电
- C19077494 SMBJ5339B
- ESP-32主控模组
- 串口自动下载电路
- WS2812B
- MAX98357A功放模块
- OLED显示屏
- INMP441麦克风模块
- 通断控制
- ML307R
- 天问ASR-PRO核心板
- RST按键
- BOOT按键
- NC
- EN
- 拨轮按键
- 串口匹配
